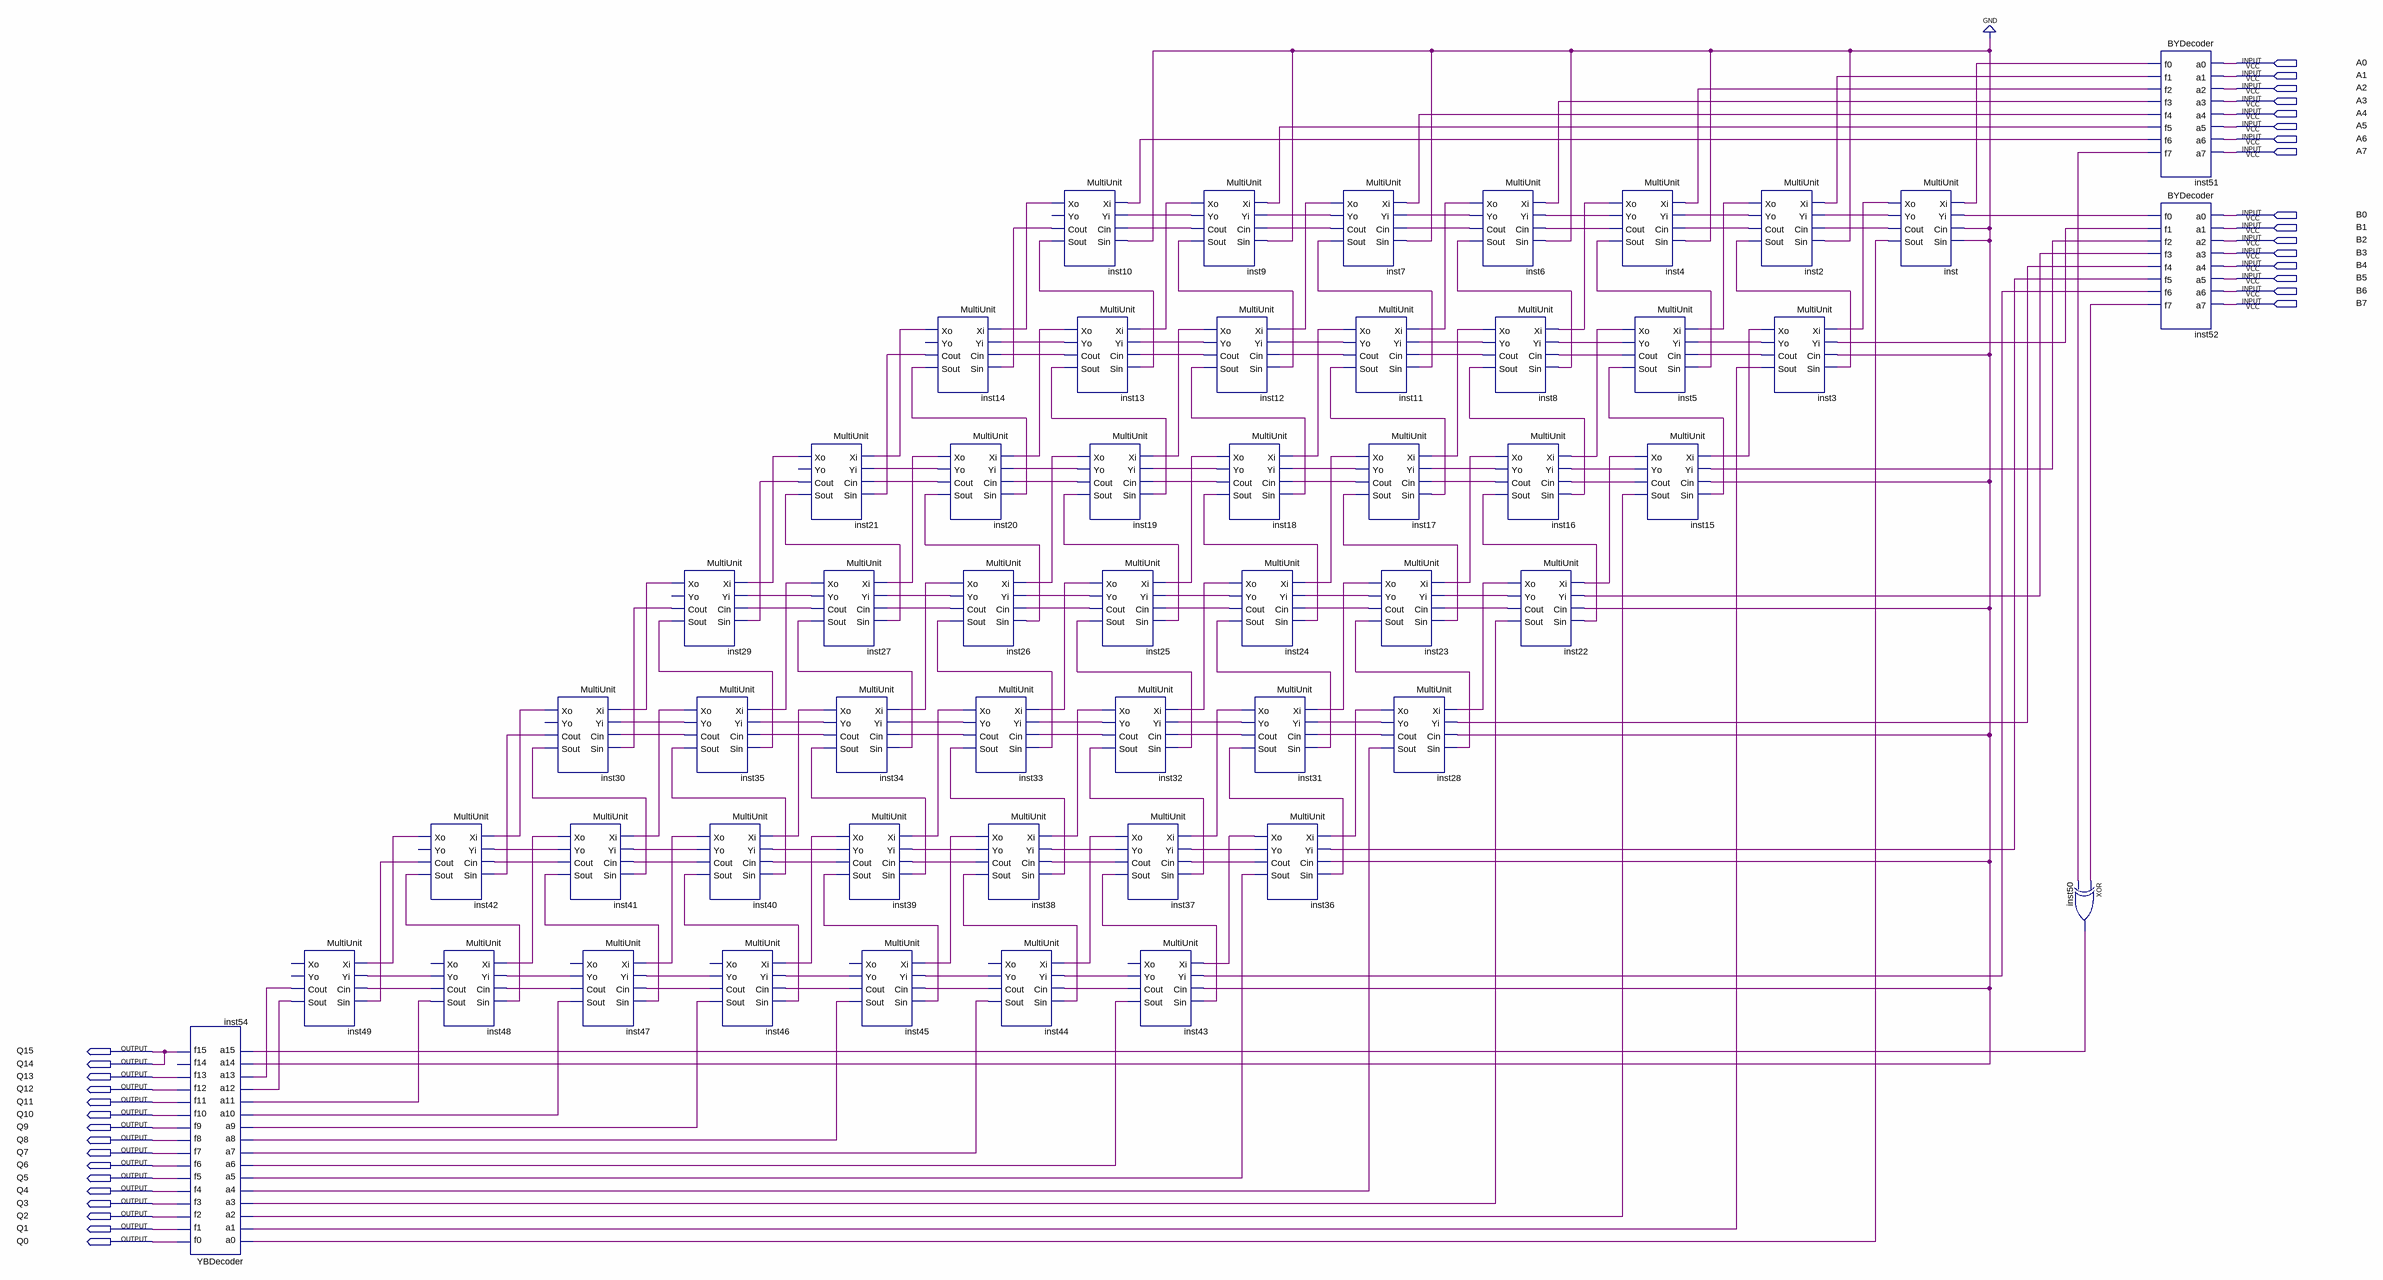
[diagram p0: schematic sheet]
// Quartus schematic Multi.bdf as structural Verilog: 53 symbols, 32 pins
module Multi (
  input  A0,
  input  A1,
  input  A2,
  input  A3,
  input  A4,
  input  A5,
  input  A6,
  input  A7,
  input  B0,
  input  B1,
  input  B2,
  input  B3,
  input  B4,
  input  B5,
  input  B6,
  input  B7,
  output Q15,
  output Q14,
  output Q13,
  output Q12,
  output Q11,
  output Q10,
  output Q9,
  output Q8,
  output Q7,
  output Q6,
  output Q5,
  output Q4,
  output Q3,
  output Q2,
  output Q1,
  output Q0
);

  wire inst2_cout, inst2_sout, inst2_xo, inst2_yo, inst3_cout, inst3_sout, inst3_xo, inst3_yo, inst4_cout,
       inst4_sout, inst4_xo, inst4_yo, inst5_cout, inst5_sout, inst5_xo, inst5_yo, inst6_cout, inst6_sout,
       inst6_xo, inst6_yo, inst7_cout, inst7_sout, inst7_xo, inst7_yo, inst8_cout, inst8_sout, inst8_xo,
       inst8_yo, inst9_cout, inst9_sout, inst9_xo, inst9_yo, inst10_cout, inst10_sout, inst10_xo,
       inst11_cout, inst11_sout, inst11_xo, inst11_yo, inst12_cout, inst12_sout, inst12_xo, inst12_yo,
       inst13_cout, inst13_sout, inst13_xo, inst13_yo, inst14_cout, inst14_sout, inst14_xo, inst15_cout,
       inst15_sout, inst15_xo, inst15_yo, inst16_cout, inst16_sout, inst16_xo, inst16_yo, inst17_cout,
       inst17_sout, inst17_xo, inst17_yo, inst18_cout, inst18_sout, inst18_xo, inst18_yo, inst19_cout,
       inst19_sout, inst19_xo, inst19_yo, inst20_cout, inst20_sout, inst20_xo, inst20_yo, inst21_cout,
       inst21_sout, inst21_xo, inst22_cout, inst22_sout, inst22_xo, inst22_yo, inst23_cout, inst23_sout,
       inst23_xo, inst23_yo, inst24_cout, inst24_sout, inst24_xo, inst24_yo, inst25_cout, inst25_sout,
       inst25_xo, inst25_yo, inst26_cout, inst26_sout, inst26_xo, inst26_yo, inst27_cout, inst27_sout,
       inst27_xo, inst27_yo, inst28_cout, inst28_sout, inst28_xo, inst28_yo, inst29_cout, inst29_sout,
       inst29_xo, inst30_cout, inst30_sout, inst30_xo, inst31_cout, inst31_sout, inst31_xo, inst31_yo,
       inst32_cout, inst32_sout, inst32_xo, inst32_yo, inst33_cout, inst33_sout, inst33_xo, inst33_yo,
       inst34_cout, inst34_sout, inst34_xo, inst34_yo, inst35_cout, inst35_sout, inst35_xo, inst35_yo,
       inst36_cout, inst36_sout, inst36_xo, inst36_yo, inst37_cout, inst37_sout, inst37_xo, inst37_yo,
       inst38_cout, inst38_sout, inst38_xo, inst38_yo, inst39_cout, inst39_sout, inst39_xo, inst39_yo,
       inst40_cout, inst40_sout, inst40_xo, inst40_yo, inst41_cout, inst41_sout, inst41_xo, inst41_yo,
       inst42_cout, inst42_sout, inst42_xo, inst43_cout, inst43_sout, inst43_yo, inst44_cout, inst44_sout,
       inst44_yo, inst45_cout, inst45_sout, inst45_yo, inst46_cout, inst46_sout, inst46_yo, inst47_cout,
       inst47_sout, inst47_yo, inst48_cout, inst48_sout, inst48_yo, inst49_cout, inst49_sout, inst50_out,
       inst51_f0, inst51_f1, inst51_f2, inst51_f3, inst51_f4, inst51_f5, inst51_f6, inst51_f7, inst52_f0,
       inst52_f1, inst52_f2, inst52_f3, inst52_f4, inst52_f5, inst52_f6, inst52_f7, inst_cout, inst_sout,
       inst_xo, inst_yo;

  YBDecoder inst54 (
    .a0(inst_sout), .a1(inst3_sout), .a2(inst15_sout), .a3(inst22_sout), .a4(inst28_sout), .a5(inst36_sout),
    .a6(inst43_sout), .a7(inst44_sout), .a8(inst45_sout), .a9(inst46_sout), .a10(inst47_sout),
    .a11(inst48_sout), .a12(inst49_sout), .a13(inst49_cout), .a14(1'b0), .a15(inst50_out), .f0(Q0), .f1(Q1),
    .f2(Q2), .f3(Q3), .f4(Q4), .f5(Q5), .f6(Q6), .f7(Q7), .f8(Q8), .f9(Q9), .f10(Q10), .f11(Q11), .f12(Q12),
    .f13(Q13), .f15(Q14));  // open: f14
  MultiUnit inst49 (
    .Xi(inst42_xo), .Yi(inst48_yo), .Cin(inst48_cout), .Sin(inst42_cout), .Cout(inst49_cout),
    .Sout(inst49_sout));  // open: Xo, Yo
  MultiUnit inst42 (
    .Xi(inst30_xo), .Yi(inst41_yo), .Cin(inst41_cout), .Sin(inst30_cout), .Xo(inst42_xo), .Cout(inst42_cout),
    .Sout(inst42_sout));  // open: Yo
  MultiUnit inst48 (
    .Xi(inst41_xo), .Yi(inst47_yo), .Cin(inst47_cout), .Sin(inst42_sout), .Yo(inst48_yo), .Cout(inst48_cout),
    .Sout(inst48_sout));  // open: Xo
  MultiUnit inst30 (
    .Xi(inst29_xo), .Yi(inst35_yo), .Cin(inst35_cout), .Sin(inst29_cout), .Xo(inst30_xo), .Cout(inst30_cout),
    .Sout(inst30_sout));  // open: Yo
  MultiUnit inst41 (
    .Xi(inst35_xo), .Yi(inst40_yo), .Cin(inst40_cout), .Sin(inst30_sout), .Xo(inst41_xo), .Yo(inst41_yo),
    .Cout(inst41_cout), .Sout(inst41_sout));
  MultiUnit inst47 (
    .Xi(inst40_xo), .Yi(inst46_yo), .Cin(inst46_cout), .Sin(inst41_sout), .Yo(inst47_yo), .Cout(inst47_cout),
    .Sout(inst47_sout));  // open: Xo
  MultiUnit inst29 (
    .Xi(inst21_xo), .Yi(inst27_yo), .Cin(inst27_cout), .Sin(inst21_cout), .Xo(inst29_xo), .Cout(inst29_cout),
    .Sout(inst29_sout));  // open: Yo
  MultiUnit inst35 (
    .Xi(inst27_xo), .Yi(inst34_yo), .Cin(inst34_cout), .Sin(inst29_sout), .Xo(inst35_xo), .Yo(inst35_yo),
    .Cout(inst35_cout), .Sout(inst35_sout));
  MultiUnit inst40 (
    .Xi(inst34_xo), .Yi(inst39_yo), .Cin(inst39_cout), .Sin(inst35_sout), .Xo(inst40_xo), .Yo(inst40_yo),
    .Cout(inst40_cout), .Sout(inst40_sout));
  MultiUnit inst46 (
    .Xi(inst39_xo), .Yi(inst45_yo), .Cin(inst45_cout), .Sin(inst40_sout), .Yo(inst46_yo), .Cout(inst46_cout),
    .Sout(inst46_sout));  // open: Xo
  MultiUnit inst21 (
    .Xi(inst14_xo), .Yi(inst20_yo), .Cin(inst20_cout), .Sin(inst14_cout), .Xo(inst21_xo), .Cout(inst21_cout),
    .Sout(inst21_sout));  // open: Yo
  MultiUnit inst27 (
    .Xi(inst20_xo), .Yi(inst26_yo), .Cin(inst26_cout), .Sin(inst21_sout), .Xo(inst27_xo), .Yo(inst27_yo),
    .Cout(inst27_cout), .Sout(inst27_sout));
  MultiUnit inst34 (
    .Xi(inst26_xo), .Yi(inst33_yo), .Cin(inst33_cout), .Sin(inst27_sout), .Xo(inst34_xo), .Yo(inst34_yo),
    .Cout(inst34_cout), .Sout(inst34_sout));
  MultiUnit inst39 (
    .Xi(inst33_xo), .Yi(inst38_yo), .Cin(inst38_cout), .Sin(inst34_sout), .Xo(inst39_xo), .Yo(inst39_yo),
    .Cout(inst39_cout), .Sout(inst39_sout));
  MultiUnit inst45 (
    .Xi(inst38_xo), .Yi(inst44_yo), .Cin(inst44_cout), .Sin(inst39_sout), .Yo(inst45_yo), .Cout(inst45_cout),
    .Sout(inst45_sout));  // open: Xo
  MultiUnit inst14 (
    .Xi(inst10_xo), .Yi(inst13_yo), .Cin(inst13_cout), .Sin(inst10_cout), .Xo(inst14_xo), .Cout(inst14_cout),
    .Sout(inst14_sout));  // open: Yo
  MultiUnit inst20 (
    .Xi(inst13_xo), .Yi(inst19_yo), .Cin(inst19_cout), .Sin(inst14_sout), .Xo(inst20_xo), .Yo(inst20_yo),
    .Cout(inst20_cout), .Sout(inst20_sout));
  MultiUnit inst26 (
    .Xi(inst19_xo), .Yi(inst25_yo), .Cin(inst25_cout), .Sin(inst20_sout), .Xo(inst26_xo), .Yo(inst26_yo),
    .Cout(inst26_cout), .Sout(inst26_sout));
  MultiUnit inst33 (
    .Xi(inst25_xo), .Yi(inst32_yo), .Cin(inst32_cout), .Sin(inst26_sout), .Xo(inst33_xo), .Yo(inst33_yo),
    .Cout(inst33_cout), .Sout(inst33_sout));
  MultiUnit inst38 (
    .Xi(inst32_xo), .Yi(inst37_yo), .Cin(inst37_cout), .Sin(inst33_sout), .Xo(inst38_xo), .Yo(inst38_yo),
    .Cout(inst38_cout), .Sout(inst38_sout));
  MultiUnit inst44 (
    .Xi(inst37_xo), .Yi(inst43_yo), .Cin(inst43_cout), .Sin(inst38_sout), .Yo(inst44_yo), .Cout(inst44_cout),
    .Sout(inst44_sout));  // open: Xo
  MultiUnit inst10 (
    .Xi(inst51_f6), .Yi(inst9_yo), .Cin(inst9_cout), .Sin(1'b0), .Xo(inst10_xo), .Cout(inst10_cout),
    .Sout(inst10_sout));  // open: Yo
  MultiUnit inst13 (
    .Xi(inst9_xo), .Yi(inst12_yo), .Cin(inst12_cout), .Sin(inst10_sout), .Xo(inst13_xo), .Yo(inst13_yo),
    .Cout(inst13_cout), .Sout(inst13_sout));
  MultiUnit inst19 (
    .Xi(inst12_xo), .Yi(inst18_yo), .Cin(inst18_cout), .Sin(inst13_sout), .Xo(inst19_xo), .Yo(inst19_yo),
    .Cout(inst19_cout), .Sout(inst19_sout));
  MultiUnit inst25 (
    .Xi(inst18_xo), .Yi(inst24_yo), .Cin(inst24_cout), .Sin(inst19_sout), .Xo(inst25_xo), .Yo(inst25_yo),
    .Cout(inst25_cout), .Sout(inst25_sout));
  MultiUnit inst32 (
    .Xi(inst24_xo), .Yi(inst31_yo), .Cin(inst31_cout), .Sin(inst25_sout), .Xo(inst32_xo), .Yo(inst32_yo),
    .Cout(inst32_cout), .Sout(inst32_sout));
  MultiUnit inst37 (
    .Xi(inst31_xo), .Yi(inst36_yo), .Cin(inst36_cout), .Sin(inst32_sout), .Xo(inst37_xo), .Yo(inst37_yo),
    .Cout(inst37_cout), .Sout(inst37_sout));
  MultiUnit inst43 (
    .Xi(inst36_xo), .Yi(inst52_f6), .Cin(1'b0), .Sin(inst37_sout), .Yo(inst43_yo), .Cout(inst43_cout),
    .Sout(inst43_sout));  // open: Xo
  MultiUnit inst9 (
    .Xi(inst51_f5), .Yi(inst7_yo), .Cin(inst7_cout), .Sin(1'b0), .Xo(inst9_xo), .Yo(inst9_yo),
    .Cout(inst9_cout), .Sout(inst9_sout));
  MultiUnit inst12 (
    .Xi(inst7_xo), .Yi(inst11_yo), .Cin(inst11_cout), .Sin(inst9_sout), .Xo(inst12_xo), .Yo(inst12_yo),
    .Cout(inst12_cout), .Sout(inst12_sout));
  MultiUnit inst18 (
    .Xi(inst11_xo), .Yi(inst17_yo), .Cin(inst17_cout), .Sin(inst12_sout), .Xo(inst18_xo), .Yo(inst18_yo),
    .Cout(inst18_cout), .Sout(inst18_sout));
  MultiUnit inst24 (
    .Xi(inst17_xo), .Yi(inst23_yo), .Cin(inst23_cout), .Sin(inst18_sout), .Xo(inst24_xo), .Yo(inst24_yo),
    .Cout(inst24_cout), .Sout(inst24_sout));
  MultiUnit inst31 (
    .Xi(inst23_xo), .Yi(inst28_yo), .Cin(inst28_cout), .Sin(inst24_sout), .Xo(inst31_xo), .Yo(inst31_yo),
    .Cout(inst31_cout), .Sout(inst31_sout));
  MultiUnit inst36 (
    .Xi(inst28_xo), .Yi(inst52_f5), .Cin(1'b0), .Sin(inst31_sout), .Xo(inst36_xo), .Yo(inst36_yo),
    .Cout(inst36_cout), .Sout(inst36_sout));
  MultiUnit inst7 (
    .Xi(inst51_f4), .Yi(inst6_yo), .Cin(inst6_cout), .Sin(1'b0), .Xo(inst7_xo), .Yo(inst7_yo),
    .Cout(inst7_cout), .Sout(inst7_sout));
  MultiUnit inst11 (
    .Xi(inst6_xo), .Yi(inst8_yo), .Cin(inst8_cout), .Sin(inst7_sout), .Xo(inst11_xo), .Yo(inst11_yo),
    .Cout(inst11_cout), .Sout(inst11_sout));
  MultiUnit inst17 (
    .Xi(inst8_xo), .Yi(inst16_yo), .Cin(inst16_cout), .Sin(inst11_sout), .Xo(inst17_xo), .Yo(inst17_yo),
    .Cout(inst17_cout), .Sout(inst17_sout));
  MultiUnit inst23 (
    .Xi(inst16_xo), .Yi(inst22_yo), .Cin(inst22_cout), .Sin(inst17_sout), .Xo(inst23_xo), .Yo(inst23_yo),
    .Cout(inst23_cout), .Sout(inst23_sout));
  MultiUnit inst28 (
    .Xi(inst22_xo), .Yi(inst52_f4), .Cin(1'b0), .Sin(inst23_sout), .Xo(inst28_xo), .Yo(inst28_yo),
    .Cout(inst28_cout), .Sout(inst28_sout));
  MultiUnit inst6 (
    .Xi(inst51_f3), .Yi(inst4_yo), .Cin(inst4_cout), .Sin(1'b0), .Xo(inst6_xo), .Yo(inst6_yo),
    .Cout(inst6_cout), .Sout(inst6_sout));
  MultiUnit inst8 (
    .Xi(inst4_xo), .Yi(inst5_yo), .Cin(inst5_cout), .Sin(inst6_sout), .Xo(inst8_xo), .Yo(inst8_yo),
    .Cout(inst8_cout), .Sout(inst8_sout));
  MultiUnit inst16 (
    .Xi(inst5_xo), .Yi(inst15_yo), .Cin(inst15_cout), .Sin(inst8_sout), .Xo(inst16_xo), .Yo(inst16_yo),
    .Cout(inst16_cout), .Sout(inst16_sout));
  MultiUnit inst22 (
    .Xi(inst15_xo), .Yi(inst52_f3), .Cin(1'b0), .Sin(inst16_sout), .Xo(inst22_xo), .Yo(inst22_yo),
    .Cout(inst22_cout), .Sout(inst22_sout));
  MultiUnit inst4 (
    .Xi(inst51_f2), .Yi(inst2_yo), .Cin(inst2_cout), .Sin(1'b0), .Xo(inst4_xo), .Yo(inst4_yo),
    .Cout(inst4_cout), .Sout(inst4_sout));
  MultiUnit inst5 (
    .Xi(inst2_xo), .Yi(inst3_yo), .Cin(inst3_cout), .Sin(inst4_sout), .Xo(inst5_xo), .Yo(inst5_yo),
    .Cout(inst5_cout), .Sout(inst5_sout));
  MultiUnit inst15 (
    .Xi(inst3_xo), .Yi(inst52_f2), .Cin(1'b0), .Sin(inst5_sout), .Xo(inst15_xo), .Yo(inst15_yo),
    .Cout(inst15_cout), .Sout(inst15_sout));
  MultiUnit inst2 (
    .Xi(inst51_f1), .Yi(inst_yo), .Cin(inst_cout), .Sin(1'b0), .Xo(inst2_xo), .Yo(inst2_yo),
    .Cout(inst2_cout), .Sout(inst2_sout));
  MultiUnit inst3 (
    .Xi(inst_xo), .Yi(inst52_f1), .Cin(1'b0), .Sin(inst2_sout), .Xo(inst3_xo), .Yo(inst3_yo),
    .Cout(inst3_cout), .Sout(inst3_sout));
  MultiUnit inst (
    .Xi(inst51_f0), .Yi(inst52_f0), .Cin(1'b0), .Sin(1'b0), .Xo(inst_xo), .Yo(inst_yo), .Cout(inst_cout),
    .Sout(inst_sout));
  xor inst50 (inst50_out, inst52_f7, inst51_f7);
  BYDecoder inst51 (
    .a0(A0), .a1(A1), .a2(A2), .a3(A3), .a4(A4), .a5(A5), .a6(A6), .a7(A7), .f0(inst51_f0), .f1(inst51_f1),
    .f2(inst51_f2), .f3(inst51_f3), .f4(inst51_f4), .f5(inst51_f5), .f6(inst51_f6), .f7(inst51_f7));
  BYDecoder inst52 (
    .a0(B0), .a1(B1), .a2(B2), .a3(B3), .a4(B4), .a5(B5), .a6(B6), .a7(B7), .f0(inst52_f0), .f1(inst52_f1),
    .f2(inst52_f2), .f3(inst52_f3), .f4(inst52_f4), .f5(inst52_f5), .f6(inst52_f6), .f7(inst52_f7));

  assign Q15 = Q14;
endmodule
